# Altium project gateway_tbl.PrjPcb
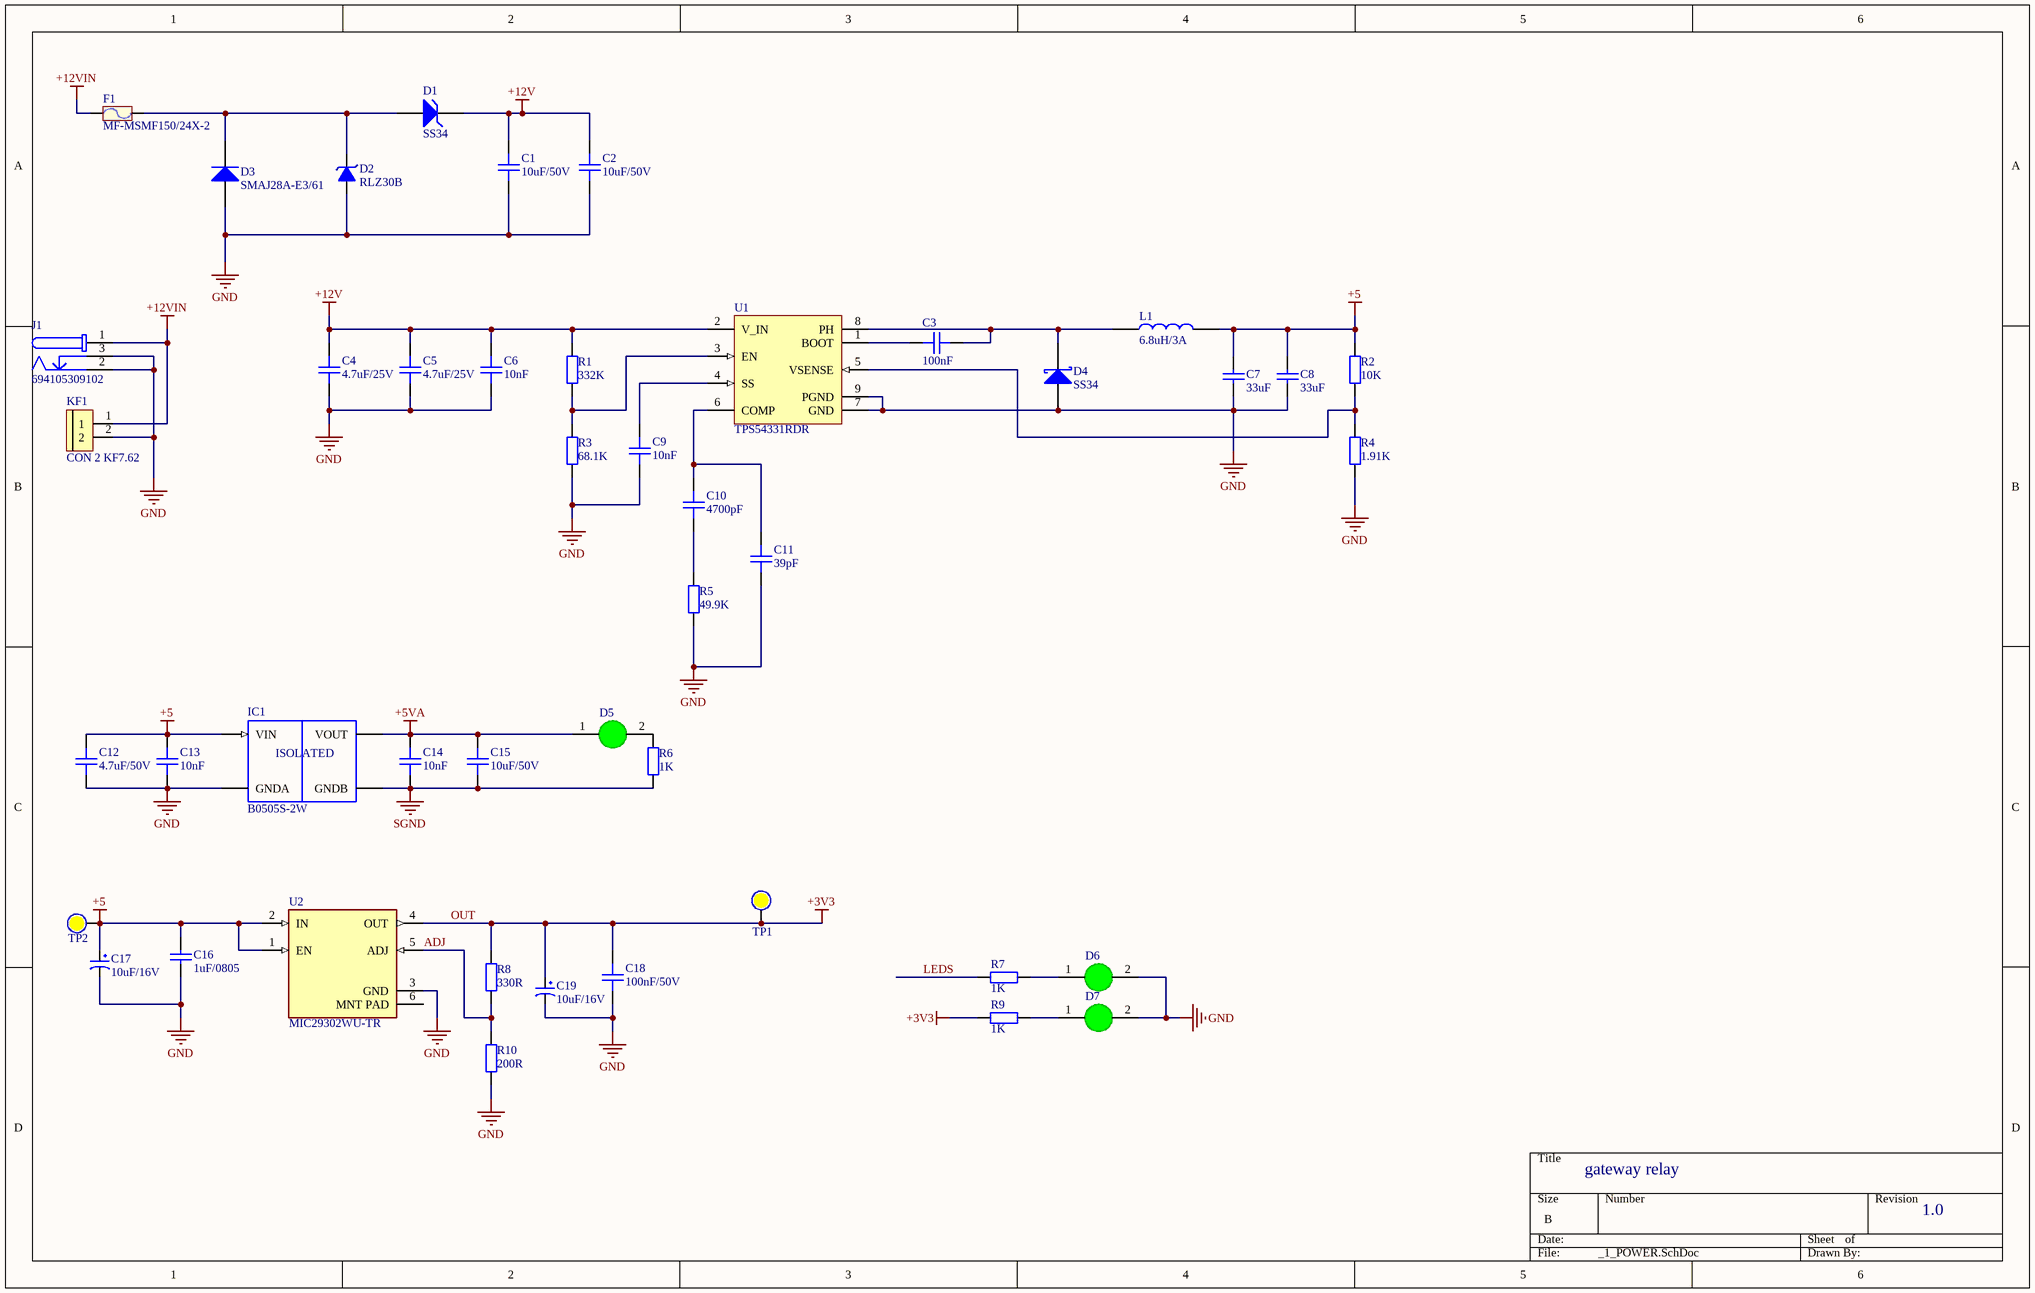
[diagram p0: _1_POWER.SchDoc]
4 sheets, 199 parts. Net scope: global (net labels, ports and power ports of the same name join across sheets).
Board file: gatewaytbl.PcbDoc
Sheets:
  _1_POWER.SchDoc
  _2_MCU.SchDoc
  _3_OUTPUT_RELAY.SchDoc
  _4_ETHERNET.SchDoc

## Sheet _1_POWER.SchDoc
size B

### Parts
C1  10uF/50V  [1210]
C2  10uF/50V  [1210]
C3  100nF  [CAPC-0603 (1608)]
C4  4.7uF/25V  [CAPC-1210 (3225)]
C5  4.7uF/25V  [CAPC-1210 (3225)]
C6  10nF  [CAPC-0603 (1608)]
C7  33uF  [tu 1206]
C8  33uF  [tu 1206]
C9  10nF  [CAPC-0603 (1608)]
C10  4700pF  [CAPC-0603 (1608)]
C11  39pF  [CAPC-0603 (1608)]
C12  4.7uF/50V  [CAPC-0805 (2012)]
C13  10nF  [CAPC-0603 (1608)]
C14  10nF  [CAPC-0603 (1608)]
C15  10uF/50V  [CAPC-0805 (2012)]
C16  1uF/0805  [tu 0805]
C17  10uF/16V  [2312]
C18  100nF/50V  [C0805]
C19  10uF/16V  [2312]
D1  SS34  [DIODE_DO214AA_SMB]
D2  RLZ30B  [SOD_80]
D3  SMAJ28A-E3/61  [VISH-DO-214AC-2_L]
D4  SS34  [DIODE_DO214AC_SMA]
D5  (no value)  [LED_0805_GREEN]
D6  (no value)  [LED_0805_GREEN]
D7  (no value)  [LED_0805_GREEN]
F1  MF-MSMF150/24X-2  [1812]
IC1  B0505S-2W  [B0505S-2W]
J1  694105309102  [PCBComponent_1]
KF1  CON 2 KF7.62  [CON 2 KF7.62]
L1  6.8uH/3A  [Cuon Cam 12x12x10]
R1  332K  [RESC-0603 (1608)]
R2  10K  [RESC-0805 (2012)]
R3  68.1K  [RESC-0603 (1608)]
R4  1.91K  [RESC-0805 (2012)]
R5  49.9K  [RESC-0603 (1608)]
R6  1K  [RESC-0805 (2012)]
R7  1K  [RESC-0805 (2012)]
R8  330R  [RESC-0805 (2012)]
R9  1K  [RESC-0805 (2012)]
R10  200R  [RESC-0805 (2012)]
TP1  (no value)  [Test Point 1 MM]  (no BOM)
TP2  (no value)  [Test Point 1 MM]  (no BOM)
U1  TPS54331RDR  [SOIC-8-TP]
U2  MIC29302WU-TR  [FP-C04-012-MFG]

### Nets
+5: C7.1 C8.1 C12.2 C13.2 C16.1 C17.1 IC1.VIN L1.2 R2.2 TP2.0 U2.1(EN) U2.2(IN)
+5VA: C14.2 C15.2 D5.1(A) IC1.VOUT
+12V: C1.2 C2.2 C4.2 C5.2 C6.2 D1.2(K) R1.2 U1.2(V_IN)
+12VIN: F1.1 J1.1 KF1.1
GND: C1.1 C2.1 C4.1 C5.1 C6.1 C7.2 C8.2 C9.1 C11.1 C12.1 C13.1 C16.2 C17.2 C18.1 C19.2 D2.1(A) D3.2(A) D4.1(A) D6.2(K) D7.2(K) IC1.GNDA J1.2 J1.3 KF1.2 R3.1 R4.1 R5.1 R10.1 U1.7(GND) U1.9(PGND) U2.3(GND)
OUT: C18.2 C19.1 R8.2 R9.1 TP1.0 U2.4(OUT)  [also labelled +3V3]
PGND: U1.9(TP)
SGND: C14.1 C15.1 IC1.GNDB R6.2
ADJ: R8.1 R10.2 U2.5(ADJ)
LEDS: R7.1
NetC3_1: C3.1 U1.1(BOOT)
NetC3_2: C3.2 D4.2(K) L1.1 U1.8(PH)
NetC9_2: C9.2 U1.4(SS)
NetC10_1: C10.1 R5.2
NetC10_2: C10.2 C11.2 U1.6(COMP)
NetD1_1: D1.1(A) D2.2(K) D3.1(K) F1.2
NetD5_2: D5.2(K) R6.1
NetD6_1: D6.1(A) R7.2
NetD7_1: D7.1(A) R9.2
NetR1_1: R1.1 R3.2 U1.3(EN)
NetR2_1: R2.1 R4.2 U1.5(VSENSE)

Not connected (* = marked no-connect by the designer): U2 6(MNT_PAD)

### Notes on the sheet
- gateway relay
- 1.0
- (in symbol B0505S-2W) ISOLATED

### Library data of the parts
C1 C2 = CAP_CER_1210_10uF: CAP CER 10uF/50V 1210; Manufacturer: Yageo; Part number: C1210; Cost: 3400; ComponentLink1Description: Link product; ComponentLink1URL: https://www.thegioiic.com/tu-gom-1210-10uf-50v; Package: 1210
C3 = CC0603ZRY5V9BB224: CAP CER 0.22UF 50V Y5V 0603; Value: 224/50V; Solder: SMT; MPN: CC0603ZRY5V9BB224; Category: CAPACITOR; PinCount: 2
C4 C5 = CC1210KKX7R9BB105: CAP CER 1UF 50V X7R 1210; MFR: Yageo; Value: 105/50V; Solder: SMT; MPN: CC1210KKX7R9BB105; Category: CAPACITOR; PinCount: 2
C6 C9 C13 C14 = CC0603KRX7R7BB103: CAP CER 10nF 16V 10% X7R 0603; CompanyID: VT-00592; Solder: SMT; Value: 103/16V; MPN: CC0603KRX7R7BB103; Category: CAPACITOR; PinCount: 2
C7 C8 = Tu 1206 100pF 50V 5%: Dán; Don_Vi: Con; So_Chan: 2; Ten_Linh_Kien: Tụ 1206 100P 5% 50V; Ma_Hang: MH008101; Chung_Loai: Dán; Kieu_Chan: *
C10 = CC0603KRX7R9BB822: CAP CER 8200PF 50V X7R 0603; MFR: Yageo; Value: 822/50V; Solder: SMT; MPN: CC0603KRX7R9BB822; Category: CAPACITOR; PinCount: 2
C11 = CC0603JRNPO9BN560: CAP CER 56PF 50V 5% COG/NPO 0603; Solder: SMT; CompanyID: VT-00150; Value: 56pF/50V; MPN: CC0603JRNPO9BN560; Category: CAPACITOR; PinCount: 2
C12 = CC0805ZRY5V6BB475: CAP CER 4.7uF -20% +80% 10V Y5V 0805; Value: 475/10V; Solder: SMT; CompanyID: VT-01178; MPN: CC0805ZRY5V6BB475; Category: CAPACITOR; PinCount: 2
C15 = CC0805MKX5R6BB226: CAP CER 22uF 20% 10V X5R 0805; Solder: SMT; Value: 226/10V; CompanyID: VT-01177; MPN: CC0805MKX5R6BB226; Category: CAPACITOR; PinCount: 2
C16 = Tu 0805 104 50V 10%: Dán; Don_Vi: Con; So_Chan: 2; Ten_Linh_Kien: Tụ 0805 104-100nF 10% 50V; Ma_Hang: MH004551; Chung_Loai: Dán; Kieu_Chan: *; ComponentLink1Description: New link; ComponentLink1URL: https://www.thegioiic.com/tu-gom-0805-1uf-25v
C17 C19 = CAP_TANT_2312_100uF: CAP TANT 100uF/10V 2312; Manufacturer: AVX; Part number: TAJC107K010RNJ; Cost: 5000; ComponentLink1Description: Link product; ComponentLink1URL: https://www.thegioiic.com/tu-tantalum-100uf-10v-2312-tajc107k010rnj; Package: 2312
C18 = CAP_CER_0805_100nF: CAP CER 100nF/50V 0805; Manufacturer: Samsung; Cost: 190; Part number: C0805; ComponentLink1Description: Link product; ComponentLink1URL: https://www.thegioiic.com/tu-gom-0805-100nf-0-1uf-50v; Package: 0805
D1 = P6SMB39AT3G: TVS DIODE 39V  600W SMB; Solder: SMT; CompanyID: VT-00089; Value: 39V/11.2A; MPN: P6SMB39AT3G
D2 = DIO_ZMM15: ZMM15 15V 500mW SMD SOD-80; Manufacturer: On Semiconductor; Cost: 250; Part number: ZMM15; Package: SOD-80 2L; ComponentLink1Description: Link product; ComponentLink1URL: https://www.thegioiic.com/rlz30b-diode-zener-27-70-29-13v-500mw-smd
D3 = CMP-0548-00227-2: Transient Voltage Suppressor, 6.40 to 231 V, 28 V Stand-off Voltage, Uni-Directional, -55 to 155 degC, 2-pin DO-214AC, Pb-Free, Tape and Reel; Manufacturer: Vishay Semiconductor; IFSM: 40 A; VBR Uni-Directional (V): 6.4 to 231; ID (uA): 1; VWM (V): 28; PPPM (W): 400, 300; PackageReference: DO-214AC-2; Packing: Tape and Reel; RoHS: TRUE; PartNumber: SMAJ28A-E3/61; PackageDescription: 2-Pin DO-214AC (SMA), Body 4.245 x 2.665 mm; Mounting Technology: Surface Mount; DatasheetVersion: 12/8/2013; Operating Junction and Storage Temperature Range: -55 to 150 degC; ComponentLink4Description: New link; ComponentLink4URL: https://www.thegioiic.com/smaj28a-e3-61-tvs-diode-28v-45-4v-do214ac
D4 = SS34: DIODE SCHOTTKY 40V 3A SMA; Solder: SMT; MPN: SS34; Value: SS34; MFR: *
D5-D7 = 17-21/G6C-FM1N2B/3T: LED GREEN CLEAR 2V4 20mA 0805 SMD; Value: 2V4/20mA; CompanyID: VT-00393; Solder: SMT; MPN: 17-21/G6C-FM1N2B/3T
F1 = FUSE_16V_2.5A: MF-MSMF250/16 16V 2.5A1812; Manufacturer: Bourns; Cost: 3000; Part number: 1812; ComponentLink1Description: Link product; ComponentLink1URL: https://www.thegioiic.com/mf-msmf150-24x-2-cau-chi-tu-phuc-hoi-1812-24v-1-5a; Package: 1812
IC1 = B0505S-2W: <h1>B0505S-2W </h1> <br> Is a 5V-5V isolated DC-DC converter <br> Specs: <br>2W (400mA) <H3> note: max 220ÂµF Capacity on rail!</h3> Datasheet: <a href="https://www.mornsun-power.com/uploads/pdf/B_S-2W.pdf">B0505S-2W</a>; Package: None; MF: MORNSUN; Value: *; SnapEDA_Link: https://www.snapeda.com/parts/B0505S-2W/MORNSUN/view-part/586697/?ref=snap; Price: None; MP: B0505S-2W; Availability: Unavailable
J1 = CMP-1502-00187-2: NexarPartId: 52645182; Current Rating: 5.5A; Insulation Resistance: 100MΩ; Gender: Male; Connector Type: Power; Shielding: Shielded; Voltage Rating (DC): 20V; Contact Plating: Tin; Contact Gender: Female; Housing Material: Polyamide; Flammability Rating: UL94 V-0; RoHS: Compliant; Termination: Through Hole; Min Operating Temperature: -40°C; REACH SVHC: Unknown; Operating Supply Voltage: 20V; Voltage Rating: 20V; Mount: Through Hole; Max Operating Temperature: 85°C; Color: Black; Packaging: Tape and Reel
KF1 = CON 2 KF7.62: Cắm; Ma_Hang: MH002053; Ten_Linh_Kien: CON 2 KF7.62-2P 7.62MM (Đen Thẳng); Chung_Loai: Cắm; Ghi_Chu: *; Kieu_Chan: *; Don_Vi: Con
L1 = CUON CAM 100uH SMD: Dán; Don_Vi: Con; Ma_Hang: MH003999; Ten_Linh_Kien: Cuộn Cảm 100uH 7x7x4MM CD74; Ma_Hang: *; Kieu_Chan: *; Chung_Loai: Dán
R1 = RC0603FR-07330KL: RES SMD 330K OHM 1% 1/10W 0603; Solder: SMT; CompanyID: VT-01025; MPN: RC0603FR-07330KL; Value: 330K; Category: RESISTOR
R2 = RC0805FR-0710KL: RES SMD 10K OHM 1% 1/8W 0805; CompanyID: VT-00007; Solder: SMT; Value: 10K; MPN: RC0805FR-0710KL; Category: RESISTOR
R3 = RC0603FR-0768KL: RES SMD 68K OHM 1% 1/10W 0603; Solder: SMT; MPN: RC0603FR-0768KL; Value: 68K; Category: RESISTOR
R4 = RC0805FR-071K1L: RES SMD 1.1K OHM 1% 1/8W 0805; Solder: SMT; CompanyID: VT-00993; Value: 1K1; MPN: RC0805FR-071K1L; Category: RESISTOR
R5 = RC0603FR0747KL: RES SMD 47K OHM 1% 1/10W 0603; CompanyID: VT-00322; Solder: SMT; Value: 47K; MPN: RC0603FR0747KL; Category: RESISTOR
R6 R7 R9 = RC0805FR-071KL: RES SMD 1K OHM 1% 1/8W 0805; Solder: SMT; CompanyID: VT-00024; Value: 1K; MPN: RC0805FR-071KL; Category: RESISTOR
R8 = RC0805FR-07330RL: RES SMD 330 OHM 1% 1/8W 0805; CompanyID: VT-00009; Solder: SMT; Value: 330R; MPN: RC0805FR-07330RL; Category: RESISTOR
R10 = RC0805FR-07300RL: RES SMD 300 OHM 1% 1/8W 0805; Solder: SMT; Value: 300R; CompanyID: VT-00929; MPN: RC0805FR-07300RL; Category: RESISTOR
TP1 TP2 = Test Point: Solder: NF
U1 = TPS54360DDAR: Step Down DC-DC Converter; Solder: SMT; MPN: TPS54360DDAR; Value: TPS54360; Category: IC
U2 = CMP-06324-000007-1: IC REG LINEAR POS ADJ 3A TO263-5; Manufacturer: Microchip; Output Voltage: 3.3-12V; Output Type: AdjustableProgrammable; Max Junction Temp: +125°C; Standoff Height: 0mm; Accuracy Percentage: 1%; Max Supply Voltage: 26V; Nominal Supply Current: 10-37mA; Number Of Outputs: 1; Dropout Voltage: 370mV; Min Supply Voltage: 2.25V; Device Class L1: Integrated Circuits (ICs); Digikey Description: IC REG LINEAR POS ADJ 3A TO263-5; Device Class L2: Power Management ICs; Lead Free: Yes; Mouser Description: LDO Voltage Regulators; Package: C04-012; Temperature: -40°C to +125°C; Temperature Range High: +125°C; Automotive: No; Device Class L3: Voltage Regulators - Linear; Category: IC; Temperature Range Low: -40°C; RoHS: TRUE; Output Current: 3A; Octopart: https://octopart.com/mic29302wu-tr-microchip-66801318; Manufacturer Part Number: MIC29302WU-TR; Height: 0.2inch; ComponentLink3Description: New link; ComponentLink3URL: https://www.thegioiic.com/mic29302-ic-dieu-chinh-dien-ap-3a

## Sheet _2_MCU.SchDoc
size B
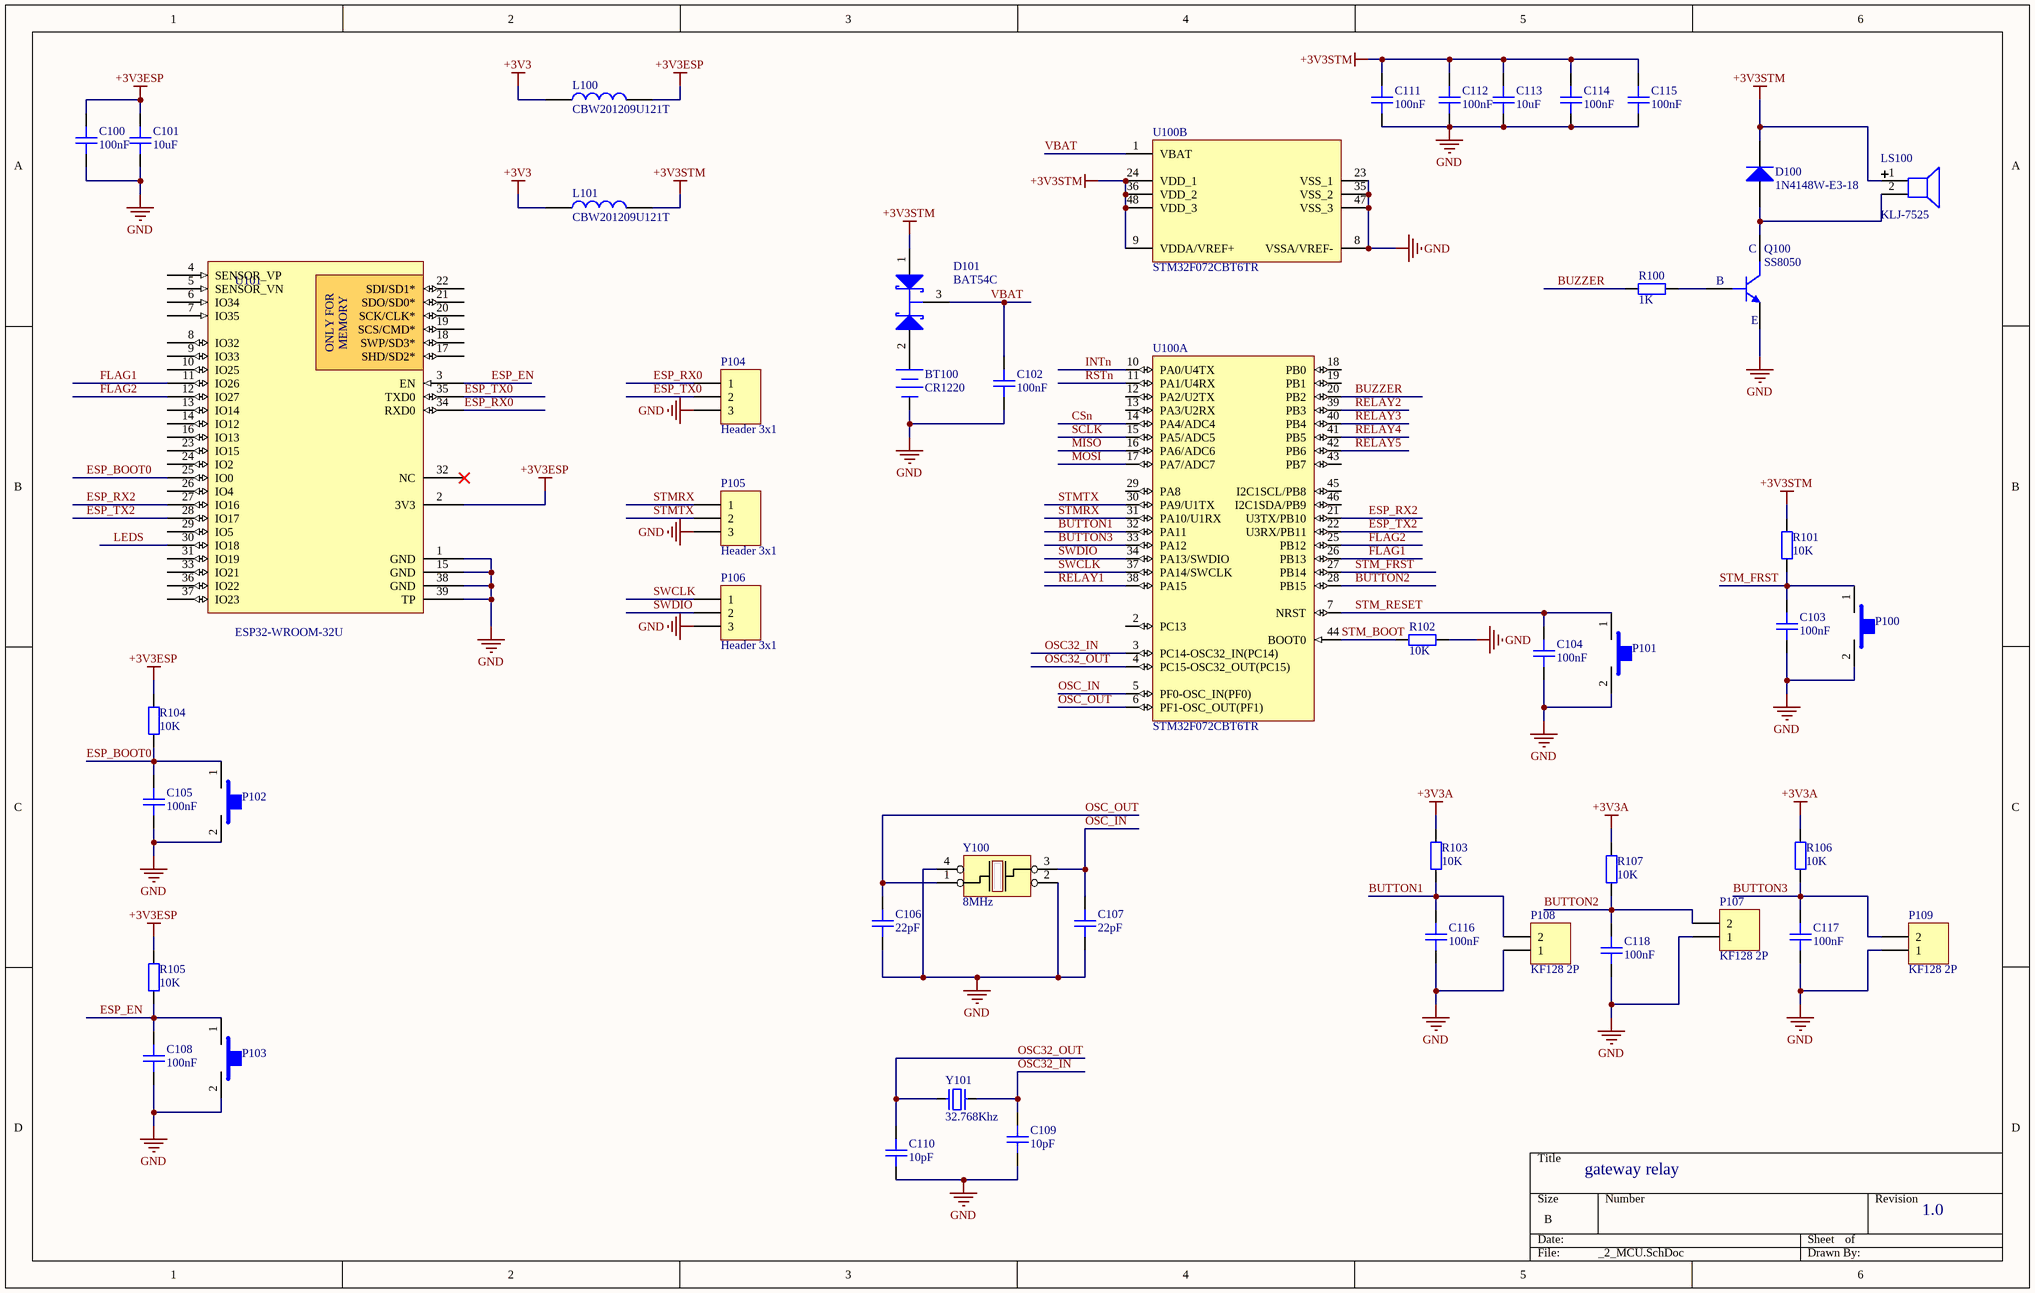
[diagram p1: _2_MCU.SchDoc]

### Parts
BT100  CR1220  [PIN3V-CR1220]
C100  100nF  [CAPC-0603 (1608)]
C101  10uF  [CAPC-0603 (1608)]
C102  100nF  [CAPC-0603 (1608)]
C103  100nF  [CAPC-0603 (1608)]
C104  100nF  [CAPC-0603 (1608)]
C105  100nF  [CAPC-0603 (1608)]
C106  22pF  [CAPC-0603 (1608)]
C107  22pF  [CAPC-0603 (1608)]
C108  100nF  [CAPC-0603 (1608)]
C109  10pF  [CAPC-0603 (1608)]
C110  10pF  [CAPC-0603 (1608)]
C111  100nF  [CAPC-0603 (1608)]
C112  100nF  [CAPC-0603 (1608)]
C113  10uF  [CAPC-0603 (1608)]
C114  100nF  [CAPC-0603 (1608)]
C115  100nF  [CAPC-0603 (1608)]
C116  100nF  [CAPC-0603 (1608)]
C117  100nF  [CAPC-0603 (1608)]
C118  100nF  [CAPC-0603 (1608)]
D100  1N4148W-E3-18  [SOD-123]
D101  BAT54C  [SOT_23_3]
L100  CBW201209U121T  [IND-0805 (2012)]
L101  CBW201209U121T  [IND-0805 (2012)]
LS100  KLJ-7525  [KLJ-7525]
P100  (no value)  [SW 2P SMD]
P101  (no value)  [SW 2P SMD]
P102  (no value)  [SW 2P SMD]
P103  (no value)  [SW 2P SMD]
P104  Header 3x1  [HDR1X3]
P105  Header 3x1  [HDR1X3]
P106  Header 3x1  [HDR1X3]
P107  KF128 2P  [KF128_2P]
P108  KF128 2P  [KF128_2P]
P109  KF128 2P  [KF128_2P]
Q100  SS8050  [SOT23_3]
R100  1K  [RESC-0603 (1608)]
R101  10K  [RESC-0603 (1608)]
R102  10K  [RESC-0603 (1608)]
R103  10K  [RESC-0603 (1608)]
R104  10K  [RESC-0603 (1608)]
R105  10K  [RESC-0603 (1608)]
R106  10K  [RESC-0603 (1608)]
R107  10K  [RESC-0603 (1608)]
U100  STM32F072CBT6TR  [LQFP-48]  (parts A,B of 2)
U101  ESP32-WROOM-32U  [ESP32-WROOM-32U]
Y100  8MHz  [CRYSTALL_SMD_3225]
Y101  32.768Khz  [Thach Anh 2 Chan 32,768 KHz]

### Nets
+3V3: L100.2 L101.1  [project net OUT]
+3V3A: R103.2 R106.2 R107.2
+3V3ESP: C100.2 C101.2 L100.1 R104.2 R105.2 U101.2(3V3)
+3V3STM: C111.2 C112.2 C113.2 C114.2 C115.2 D100.2(K) D101.1(A) L101.2 LS100.1 R101.2 U100.9(VDDA/VREF+) U100.24(VDD_1) U100.36(VDD_2) U100.48(VDD_3)
GND: BT100.2(-) C100.1 C101.1 C102.1 C103.1 C104.1 C105.1 C106.1 C107.1 C108.1 C109.1 C110.1 C111.1 C112.1 C113.1 C114.1 C115.1 C116.1 C117.1 C118.1 P100.2 P101.2 P102.2 P103.2 P104.3 P105.3 P106.3 P107.1 P108.1 P109.1 Q100.2(E) R102.1 U100.8(VSSA/VREF-) U100.23(VSS_1) U100.35(VSS_2) U100.47(VSS_3) U101.1(GND) U101.15(GND) U101.38(GND) U101.39(TP) Y100.2 Y100.4
BUTTON1: C116.2 P108.2 R103.1 U100.32(PA11)
BUTTON2: C118.2 P107.2 R107.1 U100.28(PB15)
BUTTON3: C117.2 P109.2 R106.1 U100.33(PA12)
BUZZER: R100.2 U100.20(PB2)
CSn: U100.14(PA4/ADC4)
ESP_BOOT0: C105.2 P102.1 R104.1 U101.25(IO0)
ESP_EN: C108.2 P103.1 R105.1 U101.3(EN)
ESP_RX0: P104.1 U101.34(RXD0)
ESP_RX2: U100.21(U3TX/PB10) U101.27(IO16)
ESP_TX0: P104.2 U101.35(TXD0)
ESP_TX2: U100.22(U3RX/PB11) U101.28(IO17)
FLAG1: U100.26(PB13) U101.11(IO26)
FLAG2: U100.25(PB12) U101.12(IO27)
INTn: U100.10(PA0/U4TX)
LEDS: U101.30(IO18)
MISO: U100.16(PA6/ADC6)
MOSI: U100.17(PA7/ADC7)
OSC32_IN: C109.2 U100.3(PC14-OSC32_IN(PC14)) Y101.2
OSC32_OUT: C110.2 U100.4(PC15-OSC32_OUT(PC15)) Y101.1
OSC_IN: C107.2 U100.5(PF0-OSC_IN(PF0)) Y100.3
OSC_OUT: C106.2 U100.6(PF1-OSC_OUT(PF1)) Y100.1
RELAY1: U100.38(PA15)
RELAY2: U100.39(PB3)
RELAY3: U100.40(PB4)
RELAY4: U100.41(PB5)
RELAY5: U100.42(PB6)
RSTn: U100.11(PA1/U4RX)
SCLK: U100.15(PA5/ADC5)
STM_BOOT: R102.2 U100.44(BOOT0)
STM_FRST: C103.2 P100.1 R101.1 U100.27(PB14)
STM_RESET: C104.2 P101.1 U100.7(NRST)
STMRX: P105.1 U100.31(PA10/U1RX)
STMTX: P105.2 U100.30(PA9/U1TX)
SWCLK: P106.1 U100.37(PA14/SWCLK)
SWDIO: P106.2 U100.34(PA13/SWDIO)
VBAT: C102.2 D101.3(K) U100.1(VBAT)
NetBT100_1: BT100.1(+) D101.2(A)
NetD100_1: D100.1(A) LS100.2 Q100.3(C)
NetQ100_1: Q100.1(B) R100.1

Not connected (* = marked no-connect by the designer): U100 2(PC13) 12(PA2/U2TX) 13(PA3/U2RX) 18(PB0) 19(PB1) 29(PA8) 43(PB7) 45(I2C1SCL/PB8) 46(I2C1SDA/PB9); U101 4(SENSOR_VP) 5(SENSOR_VN) 6(IO34) 7(IO35) 8(IO32) 9(IO33) 10(IO25) 13(IO14) 14(IO12) 16(IO13) 17(SHD/SD2*) 18(SWP/SD3*) 19(SCS/CMD*) 20(SCK/CLK*) 21(SDO/SD0*) 22(SDI/SD1*) 23(IO15) 24(IO2) 26(IO4) 29(IO5) 31(IO19) 32(NC)* 33(IO21) 36(IO22) 37(IO23)

### Notes on the sheet
- gateway relay
- 1.0
- (in symbol ESP32-WROOM-32U) ONLY FOR; MEMORY

### Library data of the parts
BT100 = Battery CR1220: Multicell Battery
C100 C111 C112 C114 C115 = CC0603KRX7R7BB105: CAP CER 1uF 10% 16V X7R 0603; Value: 105/16V; CompanyID: VT-00017; Solder: SMT; MPN: CC0603KRX7R7BB105; Category: CAPACITOR; PinCount: 2
C101 C113 = CC0603JRX7R9BB183: CAP CER 0.018UF 50V X7R 0603; MFR: Yageo; Value: 183/50V; Solder: SMT; MPN: CC0603JRX7R9BB183; Category: CAPACITOR; PinCount: 2
C102-C105 C108 C116-C118 = CC0603ZRY5V9BB224: as C3 on sheet _1_POWER; MPN: CC0603ZRY5V9BB224; Category: CAPACITOR; PinCount: 2
C106 C107 = CC0603KRX7R9BB221: CAP CER 220PF 50V 5% COG/NPO 0603; Solder: SMT; CompanyID: VT-01336; Value: 221/50V; MPN: CC0603KRX7R9BB221; Category: CAPACITOR; PinCount: 2
C109 C110 = CC0603CRNPO9BN2R2: CAP CER 2.2pF 50V +- 0.25pF COG/NPO 0603; Solder: SMT; CompanyID: VT-xxxxx; Value: 2P2/50V; MPN: CC0603CRNPO9BN2R2; Category: CAPACITOR; PinCount: 2
D100 = 1N4148-W-7: DIODE GEN PURP 100V 300MA SOD123; MPN: 1N4148W-7-F; MFR: Diodes Incorporated; Solder: SMT; Value: 100V/300MA
D101 = DIO_BAT54C: DIODE ARRAY SCHOTTKY 30V SOT23-3; Manufacturer: On Semiconductor; Cost: 390; Part number: BAT54C; ComponentLink1Description: Link product; ComponentLink1URL: https://www.thegioiic.com/bat54c; Package: SOT-23
L100 L101 = MPZ2012S221A: IND-FERRITE BEAD 220 OHM 0805 1LN; CompanyID: VT-00253; Solder: SMT; Value: 220OHM/3A; MPN: MPZ2012S221A; Category: FERRITE BEAD; PinCount: 2
LS100 = KLJ-7525_BUZZER: Dimension 75x75x25 mm
P100-P103 = Button 2 SMD: SMD Mini Push Button Switch 2 Pin 3x6x2.7mm; MPN: SMD Mini Push Button 2 SMD; Link: https://ram-e-shop.com/product/press2pin-smd/
P104-P106 = Header 3x1: Header, 3-Pin, pitch 2.54mm; Solder: WAVE
P107-P109 = KF128 2P: Header, 2-Pin, pitch 5.08mm; MPN: KF128-2P; Solder: WAVE
Q100 = 2SC1815: TRANS NPN 50V 0.15A SOT23-3; Solder: SMT; MPN: 2SC1815; Value: 2SC1815
R100 = RC0603FR-071KL: RES SMD 1 KOHM 1% 1/10W 0603; CompanyID: VT-00574; Solder: SMT; MPN: RC0603FR-071KL; Value: 1K; Category: RESISTOR
R101-R107 = RC0603FR-0710KL: RES SMD 10K OHM 1% 1/10W 0603; CompanyID: VT-00328; Solder: SMT; MPN: RC0603FR-0710KL; Value: 10K; Category: RESISTOR
U100 = STM32F072CBT6: IC MCU 32BIT 128KB FLASH 48LQFP; MFR: STM; Solder: SMT; Value: STM32F072CBT6TR; MPN: STM32F072CBT6TR; Category: IC
U101 = ESP32-WROOM-32U: Wi-Fi/BT BLE Module ESP32-D0WD; MFR: Espressif; Solder: SMT; Price: None; Value: ESP32-WROOM-32U; Category: MODULE; MPN: ESP32-WROOM-32U; PinCount: 40
Y100 = ABM8G-24.000MHZ-18-D2Y-T: CRYSTAL 24.0000MHZ 18PF SMD; Solder: SMT; CompanyID: VT-xxx; Value: 24MHz; MPN: ABM8G-24.000MHZ-18-D2Y-T; Category: CRYSTAL
Y101 = Thach Anh 2 chan 32,768 Khz: Crystal For all Crystal 2pin.; Value: 4Mhz

## Sheet _3_OUTPUT_RELAY.SchDoc
size B
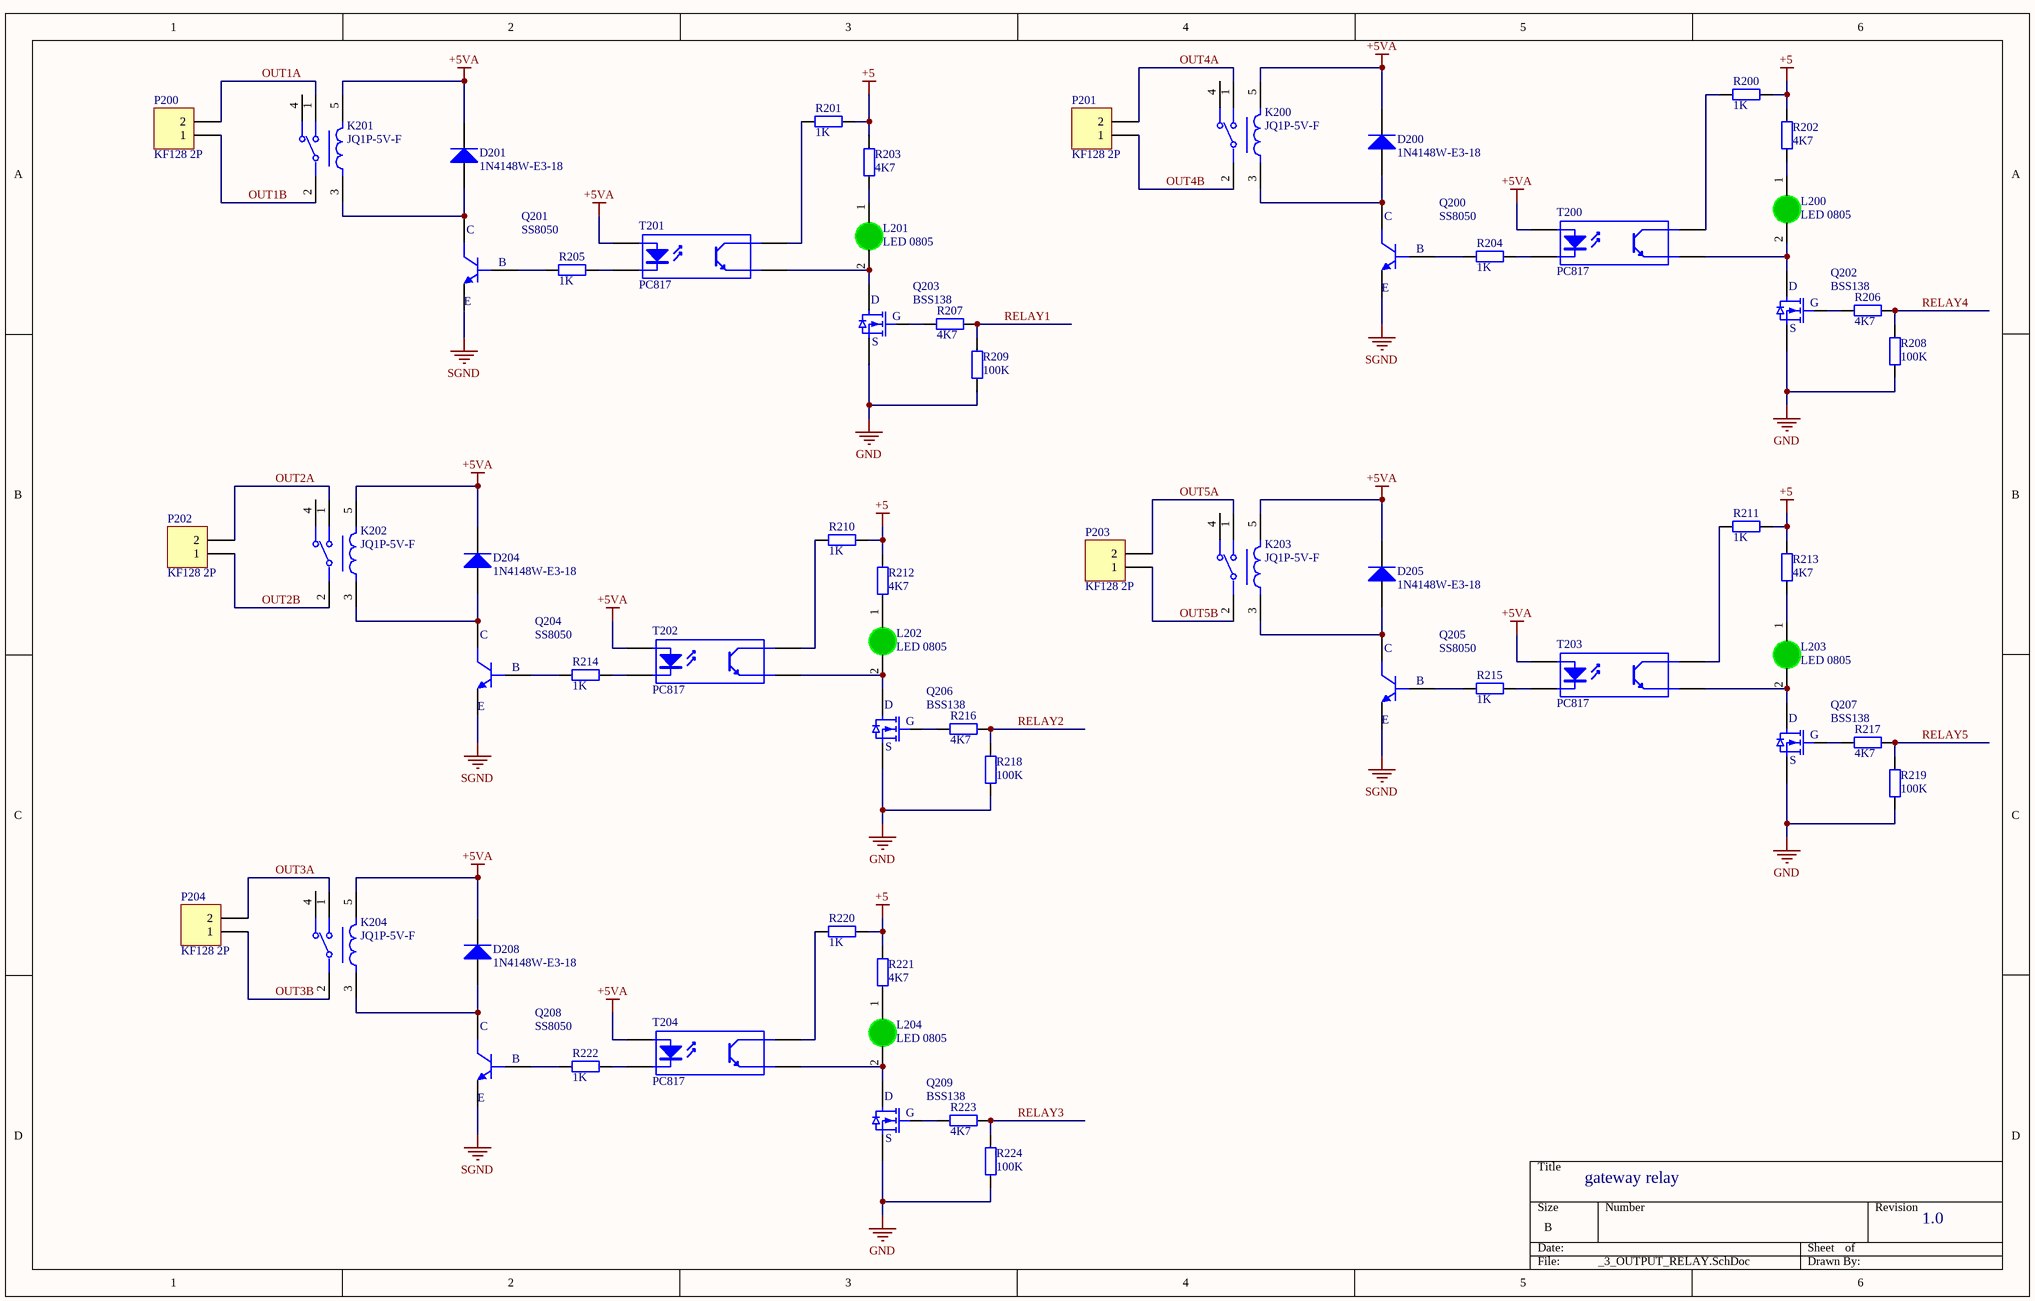
[diagram p2: _3_OUTPUT_RELAY.SchDoc]

### Parts
D200  1N4148W-E3-18  [SOD-123]
D201  1N4148W-E3-18  [SOD-123]
D204  1N4148W-E3-18  [SOD-123]
D205  1N4148W-E3-18  [SOD-123]
D208  1N4148W-E3-18  [SOD-123]
K200  JQ1P-5V-F  [FP-JQ1P-5V-F-MFG]
K201  JQ1P-5V-F  [FP-JQ1P-5V-F-MFG]
K202  JQ1P-5V-F  [FP-JQ1P-5V-F-MFG]
K203  JQ1P-5V-F  [FP-JQ1P-5V-F-MFG]
K204  JQ1P-5V-F  [FP-JQ1P-5V-F-MFG]
L200  LED 0805  [LED-0805-Green]
L201  LED 0805  [LED-0805-Green]
L202  LED 0805  [LED-0805-Green]
L203  LED 0805  [LED-0805-Green]
L204  LED 0805  [LED-0805-Green]
P200  KF128 2P  [KF128_2P]
P201  KF128 2P  [KF128_2P]
P202  KF128 2P  [KF128_2P]
P203  KF128 2P  [KF128_2P]
P204  KF128 2P  [KF128_2P]
Q200  SS8050  [SOT23_3]
Q201  SS8050  [SOT23_3]
Q202  BSS138  [SOT23_3]
Q203  BSS138  [SOT23_3]
Q204  SS8050  [SOT23_3]
Q205  SS8050  [SOT23_3]
Q206  BSS138  [SOT23_3]
Q207  BSS138  [SOT23_3]
Q208  SS8050  [SOT23_3]
Q209  BSS138  [SOT23_3]
R200  1K  [RESC-0603 (1608)]
R201  1K  [RESC-0603 (1608)]
R202  4K7  [RESC-0603 (1608)]
R203  4K7  [RESC-0603 (1608)]
R204  1K  [RESC-0603 (1608)]
R205  1K  [RESC-0603 (1608)]
R206  4K7  [RESC-0603 (1608)]
R207  4K7  [RESC-0603 (1608)]
R208  100K  [RESC-0603 (1608)]
R209  100K  [RESC-0603 (1608)]
R210  1K  [RESC-0603 (1608)]
R211  1K  [RESC-0603 (1608)]
R212  4K7  [RESC-0603 (1608)]
R213  4K7  [RESC-0603 (1608)]
R214  1K  [RESC-0603 (1608)]
R215  1K  [RESC-0603 (1608)]
R216  4K7  [RESC-0603 (1608)]
R217  4K7  [RESC-0603 (1608)]
R218  100K  [RESC-0603 (1608)]
R219  100K  [RESC-0603 (1608)]
R220  1K  [RESC-0603 (1608)]
R221  4K7  [RESC-0603 (1608)]
R222  1K  [RESC-0603 (1608)]
R223  4K7  [RESC-0603 (1608)]
R224  100K  [RESC-0603 (1608)]
T200  PC817  [OPTO TRANSISTOR_SMD-4]
T201  PC817  [OPTO TRANSISTOR_SMD-4]
T202  PC817  [OPTO TRANSISTOR_SMD-4]
T203  PC817  [OPTO TRANSISTOR_SMD-4]
T204  PC817  [OPTO TRANSISTOR_SMD-4]

### Nets
+5: R200.2 R201.2 R202.2 R203.2 R210.2 R211.2 R212.2 R213.2 R220.2 R221.2
+5VA: D200.2(K) D201.2(K) D204.2(K) D205.2(K) D208.2(K) K200.5(2_COIL) K201.5(2_COIL) K202.5(2_COIL) K203.5(2_COIL) K204.5(2_COIL) T200.1 T201.1 T202.1 T203.1 T204.1
GND: Q202.2(S) Q203.2(S) Q206.2(S) Q207.2(S) Q209.2(S) R208.1 R209.1 R218.1 R219.1 R224.1
SGND: Q200.2(E) Q201.2(E) Q204.2(E) Q205.2(E) Q208.2(E)
OUT1A: K201.1(N.O.) P200.2
OUT1B: K201.2(COM) P200.1
OUT2A: K202.1(N.O.) P202.2
OUT2B: K202.2(COM) P202.1
OUT3A: K204.1(N.O.) P204.2
OUT3B: K204.2(COM) P204.1
OUT4A: K200.1(N.O.) P201.2
OUT4B: K200.2(COM) P201.1
OUT5A: K203.1(N.O.) P203.2
OUT5B: K203.2(COM) P203.1
RELAY1: R207.1 R209.2
RELAY2: R216.1 R218.2
RELAY3: R223.1 R224.2
RELAY4: R206.1 R208.2
RELAY5: R217.1 R219.2
NetD200_1: D200.1(A) K200.3(1_COIL) Q200.3(C)
NetD201_1: D201.1(A) K201.3(1_COIL) Q201.3(C)
NetD204_1: D204.1(A) K202.3(1_COIL) Q204.3(C)
NetD205_1: D205.1(A) K203.3(1_COIL) Q205.3(C)
NetD208_1: D208.1(A) K204.3(1_COIL) Q208.3(C)
NetL200_1: L200.1(A) R202.1
NetL200_2: L200.2(K) Q202.3(D) T200.3
NetL201_1: L201.1(A) R203.1
NetL201_2: L201.2(K) Q203.3(D) T201.3
NetL202_1: L202.1(A) R212.1
NetL202_2: L202.2(K) Q206.3(D) T202.3
NetL203_1: L203.1(A) R213.1
NetL203_2: L203.2(K) Q207.3(D) T203.3
NetL204_1: L204.1(A) R221.1
NetL204_2: L204.2(K) Q209.3(D) T204.3
NetQ200_1: Q200.1(B) R204.1
NetQ201_1: Q201.1(B) R205.1
NetQ202_1: Q202.1(G) R206.2
NetQ203_1: Q203.1(G) R207.2
NetQ204_1: Q204.1(B) R214.1
NetQ205_1: Q205.1(B) R215.1
NetQ206_1: Q206.1(G) R216.2
NetQ207_1: Q207.1(G) R217.2
NetQ208_1: Q208.1(B) R222.1
NetQ209_1: Q209.1(G) R223.2
NetR200_1: R200.1 T200.4
NetR201_1: R201.1 T201.4
NetR204_2: R204.2 T200.2
NetR205_2: R205.2 T201.2
NetR210_1: R210.1 T202.4
NetR211_1: R211.1 T203.4
NetR214_2: R214.2 T202.2
NetR215_2: R215.2 T203.2
NetR220_1: R220.1 T204.4
NetR222_2: R222.2 T204.2

Not connected (* = marked no-connect by the designer): K200 4(N.C.); K201 4(N.C.); K202 4(N.C.); K203 4(N.C.); K204 4(N.C.)

### Notes on the sheet
- gateway relay
- 1.0

### Library data of the parts
D200 D201 D204 D205 D208 = 1N4148-W-7: as D100 on sheet _2_MCU
K200-K204 = CMP-05607-000163-1: RELAY GEN PURPOSE SPDT 10A 5V; Relay Type: General Purpose; Coil Current: 80mA; Power Rating: 400mW; Operate Time: 20ms; Coil Resistance: 62.5R; Release Time: 10ms; Voltage Rating (AC): 250V; Max Voltage Rating (DC): 110V; Coil Type: Non-Latching; Height: 15.6mm; Mount: Through Hole; Coil Voltage (DC): 5V; Package Quantity: 100; Width: 20mm; Lead Free: Lead Free; Throw Configuration: SPDT; Max Operating Temperature: 70°C; Contact Current Rating: 10A; Termination: PC Pin; Series: JQ; Length: 20mm; Contact Material: Tin; Weight: 7g; RoHS Compliant: Yes; Number of Pins: 5; Depth: 10mm; Packaging: Bulk; Coil Power: 400mW; Max Voltage Rating (AC): 250V; Power Consumption: 400mW; Min Operating Temperature: -40°C
L200-L204 = LED 0805 Xanh La: Dán; Don_Vi: Con; Ma_Hang: MH002326; Ten_Linh_Kien: LED 0805 Màu Xanh Lá (Green); Ghi_Chu: *; Kieu_Chan: *; Chung_Loai: Dán
P200-P204 = KF128 2P: as P107 on sheet _2_MCU
Q200 Q201 Q204 Q205 Q208 = 2SC1815: TRANS NPN 50V 0.15A SOT23-3; Solder: SMT; MPN: 2SC1815; Value: 2SC1815
Q202 Q203 Q206 Q207 Q209 = 2N7002,215: MOSFET N-CH 60V 300MA SOT-23; Solder: SMT; CompanyID: VT-00926; Value: 60V/0.3A; MPN: 2N7002,215
R200 R201 R204 R205 R210 R211 R214 R215 R220 R222 = RC0603FR-071KL: as R100 on sheet _2_MCU; MPN: RC0603FR-071KL; Value: 1K; Category: RESISTOR
R202 R203 R206 R207 R212 R213 R216 R217 R221 R223 = RC0603FR-074K7L: RES SMD 4.7K OHM 1% 1/10W 0603; CompanyID: VT-00327; Solder: SMT; MPN: RC0603FR-074K7L; Value: 4K7; Category: RESISTOR
R208 R209 R218 R219 R224 = RC0603FR-07100KL: RES SMD 100K OHM 1% 1/10W 0603; CompanyID: VT-00332; Solder: SMT; MPN: RC0603FR-07100KL; Value: 100K; Category: RESISTOR
T200-T204 = HCPL-817-500E: OPTOISOLATOR 5KV TRANSISTOR 4SMD; Value: 70V/50mA; Solder: SMT; CompanyID: VT-00147; MPN: HCPL-817-500E

## Sheet _4_ETHERNET.SchDoc
size B
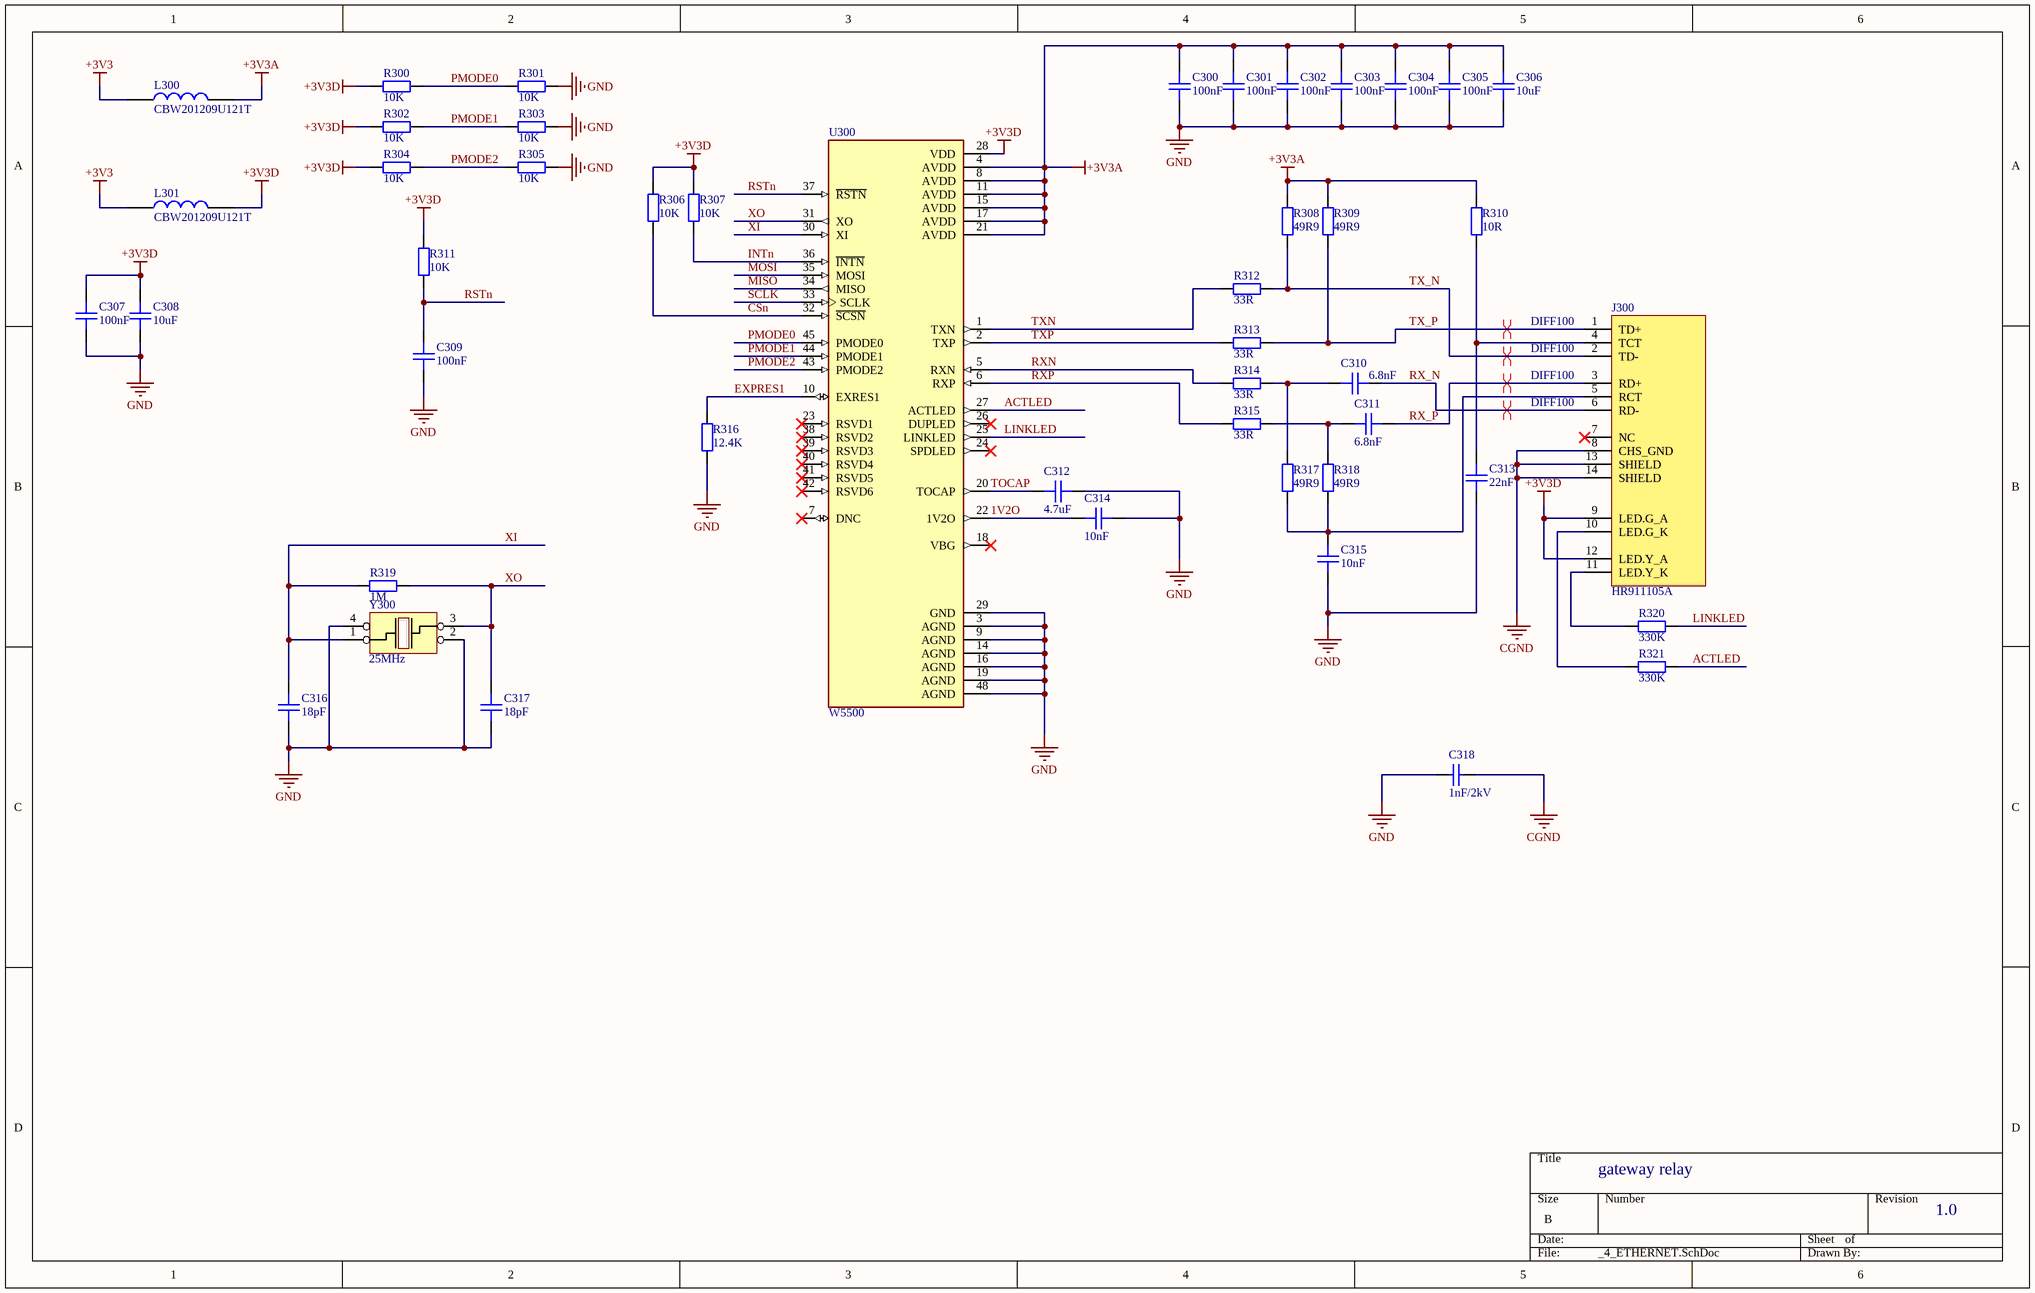
[diagram p3: _4_ETHERNET.SchDoc]

### Parts
C300  100nF  [CAPC-0603 (1608)]
C301  100nF  [CAPC-0603 (1608)]
C302  100nF  [CAPC-0603 (1608)]
C303  100nF  [CAPC-0603 (1608)]
C304  100nF  [CAPC-0603 (1608)]
C305  100nF  [CAPC-0603 (1608)]
C306  10uF  [CAPC-0603 (1608)]
C307  100nF  [CAPC-0603 (1608)]
C308  10uF  [CAPC-0603 (1608)]
C309  100nF  [CAPC-0603 (1608)]
C310  6.8nF  [CAPC-0603 (1608)]
C311  6.8nF  [CAPC-0603 (1608)]
C312  4.7uF  [CAPC-0603 (1608)]
C313  22nF  [CAPC-0603 (1608)]
C314  10nF  [CAPC-0603 (1608)]
C315  10nF  [CAPC-0603 (1608)]
C316  18pF  [CAPC-0603 (1608)]
C317  18pF  [CAPC-0603 (1608)]
C318  1nF/2kV  [tu 1206]
J300  HR911105A  [HR911105A]
L300  CBW201209U121T  [IND-0805 (2012)]
L301  CBW201209U121T  [IND-0805 (2012)]
R300  10K  [RESC-0603 (1608)]
R301  10K  [RESC-0603 (1608)]
R302  10K  [RESC-0603 (1608)]
R303  10K  [RESC-0603 (1608)]
R304  10K  [RESC-0603 (1608)]
R305  10K  [RESC-0603 (1608)]
R306  10K  [RESC-0603 (1608)]
R307  10K  [RESC-0603 (1608)]
R308  49R9  [RESC-0603 (1608)]
R309  49R9  [RESC-0603 (1608)]
R310  10R  [RESC-0603 (1608)]
R311  10K  [RESC-0603 (1608)]
R312  33R  [RESC-0603 (1608)]
R313  33R  [RESC-0603 (1608)]
R314  33R  [RESC-0603 (1608)]
R315  33R  [RESC-0603 (1608)]
R316  12.4K  [RESC-0603 (1608)]
R317  49R9  [RESC-0603 (1608)]
R318  49R9  [RESC-0603 (1608)]
R319  1M  [RESC-0603 (1608)]
R320  330K  [RESC-0603 (1608)]
R321  330K  [RESC-0603 (1608)]
U300  W5500  [QFP50P900X900X160-48N]
Y300  25MHz  [CRYSTALL_SMD_3225]

### Nets
+3V3: L300.2 L301.1  [project net OUT]
+3V3A: C300.2 C301.2 C302.2 C303.2 C304.2 C305.2 C306.2 L300.1 R308.2 R309.2 R310.2 U300.4(AVDD) U300.8(AVDD) U300.11(AVDD) U300.15(AVDD) U300.17(AVDD) U300.21(AVDD)
+3V3D: C307.2 C308.2 J300.9(LED.G_A) J300.12(LED.Y_A) L301.2 R300.1 R302.1 R304.1 R306.2 R307.2 R311.2 U300.28(VDD)
CGND: C318.1 J300.8(CHS_GND) J300.13(SHIELD) J300.14(SHIELD)
GND: C300.1 C301.1 C302.1 C303.1 C304.1 C305.1 C306.1 C307.1 C308.1 C309.1 C312.2 C313.1 C314.2 C315.1 C316.1 C317.1 C318.2 R301.2 R303.2 R305.2 R316.1 U300.3(AGND) U300.9(AGND) U300.14(AGND) U300.16(AGND) U300.19(AGND) U300.29(GND) U300.48(AGND) Y300.2 Y300.4
1V2O: C314.1 U300.22(1V2O)
ACTLED: R321.2 U300.27(ACTLED)
CSn: R306.1 U300.32(~{SCSN})
EXPRES1: R316.2 U300.10(EXRES1)
INTn: R307.1 U300.36(~{INTN})
LINKLED: R320.2 U300.25(LINKLED)
MISO: U300.34(MISO)
MOSI: U300.35(MOSI)
PMODE0: R300.2 R301.1 U300.45(PMODE0)
PMODE1: R302.2 R303.1 U300.44(PMODE1)
PMODE2: R304.2 R305.1 U300.43(PMODE2)
RSTn: C309.2 R311.1 U300.37(~{RSTN})
RX_N: C310.2 J300.6(RD-)
RX_P: C311.2 J300.3(RD+)
RXN: R314.1 U300.5(RXN)
RXP: R315.1 U300.6(RXP)
SCLK: U300.33(SCLK)
TOCAP: C312.1 U300.20(TOCAP)
TX_N: J300.2(TD-) R308.1 R312.2
TX_P: J300.1(TD+) R309.1 R313.2
TXN: R312.1 U300.1(TXN)
TXP: R313.1 U300.2(TXP)
XI: C316.2 R319.1 U300.30(XI) Y300.1
XO: C317.2 R319.2 U300.31(XO) Y300.3
NetC310_1: C310.1 R314.2 R317.2
NetC311_1: C311.1 R315.2 R318.2
NetC313_2: C313.2 J300.4(TCT) R310.1
NetC315_2: C315.2 J300.5(RCT) R317.1 R318.1
NetJ300_10: J300.10(LED.G_K) R321.1
NetJ300_11: J300.11(LED.Y_K) R320.1

Not connected (* = marked no-connect by the designer): J300 7(NC)*; U300 7(DNC)* 18(VBG)* 23(RSVD1)* 24(SPDLED)* 26(DUPLED)* 38(RSVD2)* 39(RSVD3)* 40(RSVD4)* 41(RSVD5)* 42(RSVD6)*

### Layout directives
differential pair; net class DIFF100: TX_N
differential pair; differential pair class DIFF100: RX_N, RX_P, TX_P

### Notes on the sheet
- gateway relay
- 1.0

### Library data of the parts
C300-C305 C307 C309 = CC0603KRX7R7BB105: as C100 on sheet _2_MCU; MPN: CC0603KRX7R7BB105; Category: CAPACITOR; PinCount: 2
C306 C308 = CC0603JRX7R9BB183: as C101 on sheet _2_MCU; MPN: CC0603JRX7R9BB183; Category: CAPACITOR; PinCount: 2
C310 C311 = CC0603JRX7R9BB682: CAP CER 6.8nF 5% 50V X7R 0603; CompanyID: VT-00669; Solder: SMT; Value: 682/50V; MPN: CC0603JRX7R9BB682; Category: CAPACITOR; PinCount: 2
C312 = CC0603JRNPO9BN471: CAP CER 470pF 50V 5% C0G/NPO 0603; Value: 471/50V; Solder: SMT; CompanyID: VT-01332; MPN: CC0603JRNPO9BN471; Category: CAPACITOR; PinCount: 2
C313 = CC0603KRX7R7BB224: CAP CER 0.22UF 16V X7R 0603; MFR: Yageo; Value: 224/16V; Solder: SMT; MPN: CC0603KRX7R7BB224; Category: CAPACITOR; PinCount: 2
C314 C315 = CC0603KRX7R7BB103: as C6 on sheet _1_POWER; MPN: CC0603KRX7R7BB103; Category: CAPACITOR; PinCount: 2
C316 C317 = CC0603JRNPO9BN181: CAP CER 180PF 50V 5% COG/NPO 0603; Solder: SMT; CompanyID: VT-01337; Value: 181/50V; MPN: CC0603JRNPO9BN181; Category: CAPACITOR; PinCount: 2
C318 = Tu 1206 470pF 50V 10%: Dán; Don_Vi: Con; So_Chan: 2; Ten_Linh_Kien: Tụ 1206 470P 10% 50V; Ma_Hang: MH004548; Chung_Loai: Dán; Kieu_Chan: *
J300 = HR911105A: Hanrun HR911105A RJ-45 Connector; Solder: WAVE; MPN: HR911105A; MFR: HanRun; Value: HR911105A
L300 L301 = MPZ2012S221A: as L100 on sheet _2_MCU; MPN: MPZ2012S221A; Category: FERRITE BEAD; PinCount: 2
R300-R307 R311 = RC0603FR-0710KL: as R101 on sheet _2_MCU; MPN: RC0603FR-0710KL; Value: 10K; Category: RESISTOR
R308 R309 R317 R318 = RC0603FR-0749R9L: RES SMD 49.9 OHM 1% 1/10W 0603; MFR: Yageo; Solder: SMT; MPN: RC0603FR-0749R9L; Value: 49R9; Category: RESISTOR; PinCount: 2
R310 = RC0603FR-0710RL: RES SMD 10 OHM 1% 1/10W 0603; CompanyID: VT-00865; Solder: SMT; MPN: RC0603FR-0710RL; Value: 10R; Category: RESISTOR
R312-R315 = RC0603FR-0733RL: RES SMD 33 OHM 1% 1/10W 0603; MFR: Yageo; Solder: SMT; MPN: RC0603FR-0733RL; Value: 33R; Category: RESISTOR
R316 = RC0603FR-0712KL: RES SMD 12KOHM 1% 1/10W 0603; Solder: SMT; Value: 12K; CompanyID: *; MPN: RC0603FR-0712KL; Category: RESISTOR
R319 = RC0603FR-0710ML: RES SMD 10M OHM 1% 1/10W 0603; Solder: SMT; MPN: RC0603FR-0710ML; Value: 10M; Category: RESISTOR
R320 R321 = RC0603FR-07330KL: as R1 on sheet _1_POWER; MPN: RC0603FR-07330KL; Value: 330K; Category: RESISTOR
U300 = W5500: Hardwired TCP/IP embedded Ethernet controller; Availability: Unavailable; MP: W5500; Value: *; Price: None; Package: None
Y300 = ABM8G-25.000MHZ-18-D2Y-T: CRYSTAL 25.0000MHZ 18PF SMD; MFR: Abracon LLC; Solder: SMT; CompanyID: VT-xxx; MPN: ABM8G-25.000MHZ-18-D2Y-T; Value: 25MHz; Category: CRYSTAL

## Nets that join several sheets
+3V3A: _2_MCU (R103.2 R106.2 R107.2), _4_ETHERNET (17 pins)
+5: _1_POWER (12 pins), _3_OUTPUT_RELAY (10 pins)
+5VA: _1_POWER (C14.2 C15.2 D5.1 IC1.VOUT), _3_OUTPUT_RELAY (15 pins)
GND: _1_POWER (31 pins), _2_MCU (42 pins), _3_OUTPUT_RELAY (10 pins), _4_ETHERNET (30 pins)
OUT: _1_POWER (6 pins), _2_MCU (L100.2 L101.1), _4_ETHERNET (L300.2 L301.1)
SGND: _1_POWER (C14.1 C15.1 IC1.GNDB R6.2), _3_OUTPUT_RELAY (5 pins)
CSn: _2_MCU (U100.14), _4_ETHERNET (R306.1 U300.32)
INTn: _2_MCU (U100.10), _4_ETHERNET (R307.1 U300.36)
LEDS: _1_POWER (R7.1), _2_MCU (U101.30)
MISO: _2_MCU (U100.16), _4_ETHERNET (U300.34)
MOSI: _2_MCU (U100.17), _4_ETHERNET (U300.35)
RELAY1: _2_MCU (U100.38), _3_OUTPUT_RELAY (R207.1 R209.2)
RELAY2: _2_MCU (U100.39), _3_OUTPUT_RELAY (R216.1 R218.2)
RELAY3: _2_MCU (U100.40), _3_OUTPUT_RELAY (R223.1 R224.2)
RELAY4: _2_MCU (U100.41), _3_OUTPUT_RELAY (R206.1 R208.2)
RELAY5: _2_MCU (U100.42), _3_OUTPUT_RELAY (R217.1 R219.2)
RSTn: _2_MCU (U100.11), _4_ETHERNET (C309.2 R311.1 U300.37)
SCLK: _2_MCU (U100.15), _4_ETHERNET (U300.33)